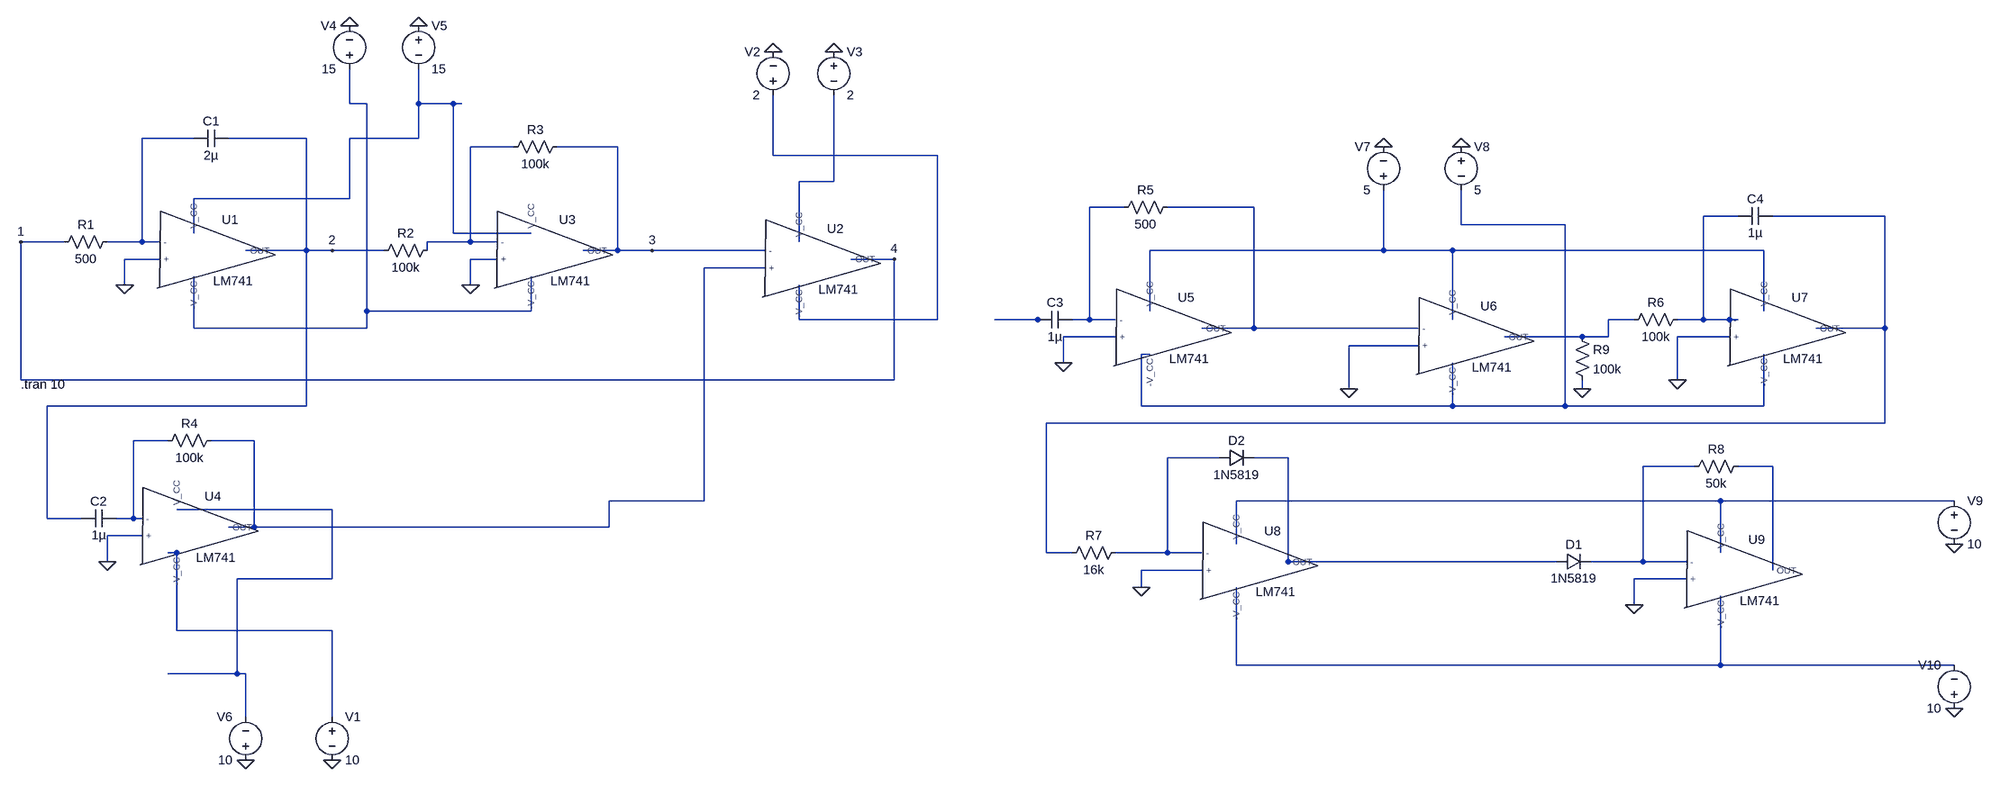
[diagram p0: schematic VCO_FINAL_DIFFERENTIATOR OPAM[.asc]
VCO_FINAL_DIFFERENTIATOR OPAM[.asc, the LTspice schematic file:
Version 4.1
SHEET 1 3880 1156
WIRE 288 -112 288 -176
WIRE 320 -112 288 -112
WIRE 416 -112 416 -176
WIRE 480 -112 416 -112
WIRE 496 -112 480 -112
WIRE 0 -48 -96 -48
WIRE 208 -48 64 -48
WIRE 416 -48 416 -112
WIRE 416 -48 288 -48
WIRE 592 -32 512 -32
WIRE 784 -32 672 -32
WIRE 1072 -16 1072 -128
WIRE 1376 -16 1072 -16
WIRE 1184 32 1184 -128
WIRE 1184 32 1120 32
WIRE 288 64 288 -48
WIRE 288 64 0 64
WIRE 2288 80 2224 80
WIRE 2528 80 2368 80
WIRE 3424 96 3360 96
WIRE 3696 96 3488 96
WIRE 2912 112 2912 48
WIRE 3104 112 2912 112
WIRE 0 128 0 64
WIRE 480 128 480 -112
WIRE 624 128 480 128
WIRE -240 144 -320 144
WIRE -96 144 -96 -48
WIRE -96 144 -160 144
WIRE -64 144 -96 144
WIRE 512 144 512 -32
WIRE 512 144 432 144
WIRE 560 144 512 144
WIRE 1120 144 1120 32
WIRE 208 160 208 -48
WIRE 208 160 96 160
WIRE 256 160 208 160
WIRE 352 160 256 160
WIRE 432 160 432 144
WIRE 784 160 784 -32
WIRE 784 160 720 160
WIRE 848 160 784 160
WIRE 1056 160 848 160
WIRE 2768 160 2768 48
WIRE 2768 160 2336 160
WIRE 2896 160 2768 160
WIRE 3472 160 2896 160
WIRE -64 176 -128 176
WIRE 560 176 512 176
WIRE 1296 176 1216 176
WIRE 1056 192 944 192
WIRE -128 224 -128 176
WIRE 512 224 512 176
WIRE 320 272 320 -112
WIRE 624 272 624 208
WIRE 624 272 320 272
WIRE 2336 272 2336 160
WIRE 3472 272 3472 160
WIRE 1120 288 1120 224
WIRE 1376 288 1376 -16
WIRE 1376 288 1120 288
WIRE 2128 288 2048 288
WIRE 2144 288 2128 288
WIRE 2224 288 2224 80
WIRE 2224 288 2192 288
WIRE 2272 288 2224 288
WIRE 2896 288 2896 160
WIRE 3232 288 3184 288
WIRE 3360 288 3360 96
WIRE 3360 288 3312 288
WIRE 3408 288 3360 288
WIRE 3424 288 3408 288
WIRE 0 304 0 208
WIRE 320 304 320 272
WIRE 320 304 0 304
WIRE 2528 304 2528 80
WIRE 2528 304 2432 304
WIRE 2832 304 2528 304
WIRE 3696 304 3696 96
WIRE 3696 304 3568 304
WIRE 2272 320 2176 320
WIRE 3136 320 2992 320
WIRE 3184 320 3184 288
WIRE 3184 320 3136 320
WIRE 3408 320 3312 320
WIRE 2832 336 2704 336
WIRE 2336 352 2320 352
WIRE 2176 368 2176 320
WIRE -320 400 -320 144
WIRE 1296 400 1296 176
WIRE 1296 400 -320 400
WIRE 3312 400 3312 320
WIRE 2704 416 2704 336
WIRE 3136 416 3136 400
WIRE 208 448 208 160
WIRE 208 448 -272 448
WIRE 2320 448 2320 352
WIRE 2896 448 2896 368
WIRE 2896 448 2320 448
WIRE 3104 448 3104 112
WIRE 3104 448 2896 448
WIRE 3472 448 3472 352
WIRE 3472 448 3104 448
WIRE 3696 480 3696 304
WIRE 3696 480 2144 480
WIRE -48 512 -112 512
WIRE 112 512 32 512
WIRE 2464 544 2368 544
WIRE 2592 544 2528 544
WIRE 3344 560 3248 560
WIRE 3488 560 3424 560
WIRE 944 624 944 192
WIRE 944 624 768 624
WIRE 3392 624 2496 624
WIRE 3824 624 3392 624
WIRE 256 640 -32 640
WIRE -272 656 -272 448
WIRE -208 656 -272 656
WIRE -112 656 -112 512
WIRE -112 656 -144 656
WIRE -96 656 -112 656
WIRE 112 672 112 512
WIRE 112 672 64 672
WIRE 768 672 768 624
WIRE 768 672 112 672
WIRE -96 688 -160 688
WIRE 2496 704 2496 624
WIRE -32 720 -48 720
WIRE 2144 720 2144 480
WIRE 2192 720 2144 720
WIRE 2368 720 2368 544
WIRE 2368 720 2272 720
WIRE 2432 720 2368 720
WIRE 3392 720 3392 624
WIRE -160 736 -160 688
WIRE 2592 736 2592 544
WIRE 3088 736 2592 736
WIRE 3248 736 3248 560
WIRE 3248 736 3152 736
WIRE 3328 736 3248 736
WIRE 2432 752 2320 752
WIRE 3488 752 3488 560
WIRE 256 768 256 640
WIRE 256 768 80 768
WIRE 3328 768 3232 768
WIRE 2320 784 2320 752
WIRE 3232 816 3232 768
WIRE -32 864 -32 720
WIRE 256 864 -32 864
WIRE 2496 928 2496 784
WIRE 3392 928 3392 800
WIRE 3392 928 2496 928
WIRE 3824 928 3392 928
WIRE 80 944 80 768
WIRE 80 944 -48 944
WIRE 96 944 80 944
WIRE 96 1024 96 944
WIRE 256 1024 256 864
FLAG 1072 -208 0
FLAG 1184 -208 0
FLAG 288 -256 0
FLAG 416 -256 0
FLAG 512 224 0
FLAG -128 224 0
FLAG 96 1104 0
FLAG 256 1104 0
FLAG -160 736 0
FLAG -320 144 1
FLAG 256 160 2
FLAG 848 160 3
FLAG 1296 176 4
FLAG 2704 416 0
FLAG 3312 400 0
FLAG 2176 368 0
FLAG 2320 784 0
FLAG 3232 816 0
FLAG 2912 -32 0
FLAG 2768 -32 0
FLAG 3824 704 0
FLAG 3824 1008 0
FLAG 3136 416 0
SYMBOL LM741 0 160 R0
SYMATTR InstName U1
SYMBOL LM741 1120 176 R0
SYMATTR InstName U2
SYMBOL res -144 128 R90
WINDOW 0 0 56 VBottom 2
WINDOW 3 32 56 VTop 2
SYMATTR InstName R1
SYMATTR Value 500
SYMBOL cap 64 -64 R90
WINDOW 0 0 32 VBottom 2
WINDOW 3 32 32 VTop 2
SYMATTR InstName C1
SYMATTR Value 2µ
SYMBOL LM741 624 160 R0
SYMATTR InstName U3
SYMBOL res 448 144 R90
WINDOW 0 0 56 VBottom 2
WINDOW 3 32 56 VTop 2
SYMATTR InstName R2
SYMATTR Value 100k
SYMBOL res 688 -48 R90
WINDOW 0 0 56 VBottom 2
WINDOW 3 32 56 VTop 2
SYMATTR InstName R3
SYMATTR Value 100k
SYMBOL voltage 1072 -112 R180
WINDOW 0 24 96 Left 2
WINDOW 3 24 16 Left 2
WINDOW 123 0 0 Left 0
WINDOW 39 0 0 Left 0
SYMATTR InstName V2
SYMATTR Value 2
SYMBOL voltage 1184 -224 R0
WINDOW 123 0 0 Left 0
WINDOW 39 0 0 Left 0
SYMATTR InstName V3
SYMATTR Value 2
SYMBOL voltage 288 -160 R180
WINDOW 0 24 96 Left 2
WINDOW 3 24 16 Left 2
WINDOW 123 0 0 Left 0
WINDOW 39 0 0 Left 0
SYMATTR InstName V4
SYMATTR Value 15
SYMBOL voltage 416 -272 R0
WINDOW 123 0 0 Left 0
WINDOW 39 0 0 Left 0
SYMATTR InstName V5
SYMATTR Value 15
SYMBOL LM741 -32 672 R0
SYMATTR InstName U4
SYMBOL cap -144 640 R90
WINDOW 0 0 32 VBottom 2
WINDOW 3 32 32 VTop 2
SYMATTR InstName C2
SYMATTR Value 1µ
SYMBOL res 48 496 R90
WINDOW 0 0 56 VBottom 2
WINDOW 3 32 56 VTop 2
SYMATTR InstName R4
SYMATTR Value 100k
SYMBOL voltage 256 1008 R0
WINDOW 123 0 0 Left 0
WINDOW 39 0 0 Left 0
SYMATTR InstName V1
SYMATTR Value 10
SYMBOL voltage 96 1120 R180
WINDOW 0 24 96 Left 2
WINDOW 3 24 16 Left 2
WINDOW 123 0 0 Left 0
WINDOW 39 0 0 Left 0
SYMATTR InstName V6
SYMATTR Value 10
SYMBOL LM741 2336 304 R0
SYMATTR InstName U5
SYMBOL LM741 2896 320 R0
SYMATTR InstName U6
SYMBOL LM741 3472 304 R0
SYMATTR InstName U7
SYMBOL cap 2192 272 R90
WINDOW 0 0 32 VBottom 2
WINDOW 3 32 32 VTop 2
SYMATTR InstName C3
SYMATTR Value 1µ
SYMBOL res 2384 64 R90
WINDOW 0 0 56 VBottom 2
WINDOW 3 32 56 VTop 2
SYMATTR InstName R5
SYMATTR Value 500
SYMBOL res 3328 272 R90
WINDOW 0 0 56 VBottom 2
WINDOW 3 32 56 VTop 2
SYMATTR InstName R6
SYMATTR Value 100k
SYMBOL cap 3488 80 R90
WINDOW 0 0 32 VBottom 2
WINDOW 3 32 32 VTop 2
SYMATTR InstName C4
SYMATTR Value 1µ
SYMBOL LM741 2496 736 R0
SYMATTR InstName U8
SYMBOL LM741 3392 752 R0
SYMATTR InstName U9
SYMBOL diode 3088 752 R270
WINDOW 0 32 32 VTop 2
WINDOW 3 0 32 VBottom 2
SYMATTR InstName D1
SYMATTR Value 1N5819
SYMBOL diode 2464 560 R270
WINDOW 0 32 32 VTop 2
WINDOW 3 0 32 VBottom 2
SYMATTR InstName D2
SYMATTR Value 1N5819
SYMBOL res 2288 704 R90
WINDOW 0 0 56 VBottom 2
WINDOW 3 32 56 VTop 2
SYMATTR InstName R7
SYMATTR Value 16k
SYMBOL res 3440 544 R90
WINDOW 0 0 56 VBottom 2
WINDOW 3 32 56 VTop 2
SYMATTR InstName R8
SYMATTR Value 50k
SYMBOL voltage 2768 64 R180
WINDOW 0 24 96 Left 2
WINDOW 3 24 16 Left 2
WINDOW 123 0 0 Left 0
WINDOW 39 0 0 Left 0
SYMATTR InstName V7
SYMATTR Value 5
SYMBOL voltage 2912 -48 R0
WINDOW 123 0 0 Left 0
WINDOW 39 0 0 Left 0
SYMATTR InstName V8
SYMATTR Value 5
SYMBOL voltage 3824 608 R0
WINDOW 123 0 0 Left 0
WINDOW 39 0 0 Left 0
SYMATTR InstName V9
SYMATTR Value 10
SYMBOL voltage 3824 1024 R180
WINDOW 0 24 96 Left 2
WINDOW 3 24 16 Left 2
WINDOW 123 0 0 Left 0
WINDOW 39 0 0 Left 0
SYMATTR InstName V10
SYMATTR Value 10
SYMBOL res 3120 304 R0
SYMATTR InstName R9
SYMATTR Value 100k
TEXT -320 408 Left 2 !.tran 10

The netlist it stands for:
* VCO_FINAL_DIFFERENTIATOR OPAM[.asc
X§U1 0 N003 N002 N001 2 LM741  ; pins + - V_CC -V_CC OUT
X§U2 N013 3 N006 N005 4 LM741  ; pins + - V_CC -V_CC OUT
R1 N003 4 500
C1 2 N003 2µ
X§U3 0 N004 N002 N001 3 LM741  ; pins + - V_CC -V_CC OUT
R2 N004 2 100k
R3 3 N004 100k
V2 N005 0 2
V3 0 N006 2
V4 N001 0 15
V5 0 N002 15
X§U4 0 N016 N022 N023 N013 LM741  ; pins + - V_CC -V_CC OUT
C2 N016 2 1µ
R4 N013 N016 100k
V1 N023 0 10
V6 0 N022 10
X§U5 0 N007 N012 N011 N008 LM741  ; pins + - V_CC -V_CC OUT
X§U6 0 N008 N012 N011 N015 LM741  ; pins + - V_CC -V_CC OUT
X§U7 0 N009 N012 N011 N010 LM741  ; pins + - V_CC -V_CC OUT
C3 N007 N014 1µ
R5 N008 N007 500
R6 N009 N015 100k
C4 N010 N009 1µ
X§U8 0 N017 N021 N024 N018 LM741  ; pins + - V_CC -V_CC OUT
X§U9 0 N019 N021 N024 N020 LM741  ; pins + - V_CC -V_CC OUT
D1 N018 N019 1N5819
D2 N017 N018 1N5819
R7 N017 N010 16k
R8 N020 N019 50k
V7 N012 0 5
V8 0 N011 5
V9 N021 0 10
V10 0 N024 10
R9 N015 0 100k
.model D D
.lib standard.dio
.tran 10
.lib F:\DOWNLOADS\snom211b\lm741.lib
.backanno
.end